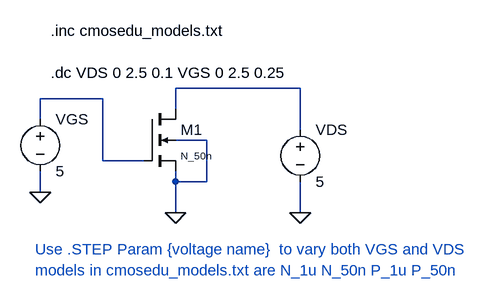
[diagram p0: schematic NMOS_Char2.asc]
NMOS_Char2.asc, the LTspice schematic file:
Version 4.1
SHEET 1 1228 680
WIRE 384 80 192 80
WIRE 80 96 -16 96
WIRE 192 112 192 80
WIRE -16 128 -16 96
WIRE 384 144 384 80
WIRE 240 160 192 160
WIRE 80 192 80 96
WIRE 144 192 80 192
WIRE 192 224 192 208
WIRE 240 224 240 160
WIRE 240 224 192 224
WIRE -16 240 -16 208
WIRE 192 272 192 224
WIRE 384 272 384 224
FLAG -16 240 0
FLAG 192 272 0
FLAG 384 272 0
SYMBOL nmos4 144 112 R0
WINDOW 3 56 72 Left 1
SYMATTR Value N_50n
SYMATTR InstName M1
SYMATTR Value2 l=100n w=1000n
SYMBOL voltage -16 112 R0
WINDOW 123 0 0 Left 0
WINDOW 39 0 0 Left 0
SYMATTR InstName VGS
SYMATTR Value 5
SYMBOL voltage 384 128 R0
WINDOW 123 0 0 Left 0
WINDOW 39 0 0 Left 0
SYMATTR InstName VDS
SYMATTR Value 5
TEXT 0 -8 Left 2 !.inc cmosedu_models.txt
TEXT -24 328 Left 2 ;Use .STEP Param {voltage name}  to vary both VGS and VDS
TEXT -24 360 Left 2 ;models in cmosedu_models.txt are N_1u N_50n P_1u P_50n
TEXT 0 56 Left 2 !.dc VDS 0 2.5 0.1 VGS 0 2.5 0.25

The netlist it stands for:
* NMOS_Char2.asc
M1 N001 N002 0 0 N_50n l=100n w=1000n
VGS N002 0 5
VDS N001 0 5
.model NMOS NMOS
.model PMOS PMOS
.lib standard.mos
.inc cmosedu_models.txt
* Use .STEP Param {voltage name}  to vary both VGS and VDS
* models in cmosedu_models.txt are N_1u N_50n P_1u P_50n
.dc VDS 0 2.5 0.1 VGS 0 2.5 0.25
.backanno
.end